# Altium schematic sheet CATS-EUROC-Telemetry.SchDoc: CATS EuRoC Edition
size A4; Author: Luca Jost; Revision: V1.0; SheetNumber: 11; SheetTotal: 16; Subtitle: Telemetry
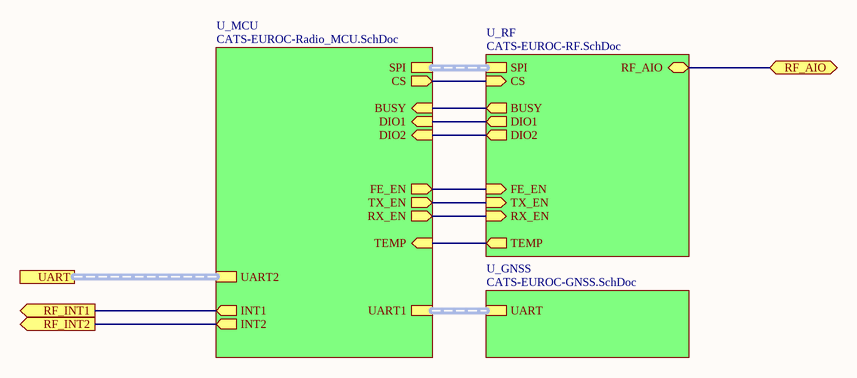
[diagram p0: CATS-EUROC-Telemetry.SchDoc]

## Sub-sheets
U_GNSS = CATS-EUROC-GNSS.SchDoc: UART (harness UART)
U_MCU = CATS-EUROC-Radio_MCU.SchDoc: SPI (harness SPI), CS (out), FE_EN (out), TX_EN (out), BUSY (in), DIO1 (in), DIO2 (in), TEMP (in), UART1 (harness UART), UART2 (harness UART), RX_EN (out), INT1 (out), INT2 (out)
U_RF = CATS-EUROC-RF.SchDoc: SPI (harness SPI), CS (in), BUSY (out), DIO1 (out), DIO2 (out), TEMP (out), FE_EN (in), TX_EN (in), RX_EN (in), RF_AIO (bidir)

## Ports
RF_AIO (bidir), RF_INT1 (out), RF_INT2 (out), UART

## Nets
RF_AIO: port RF_AIO, sheet U_RF/RF_AIO
RF_INT1: port RF_INT1, sheet U_MCU/INT1
RF_INT2: port RF_INT2, sheet U_MCU/INT2
(unnamed): sheet U_MCU/CS, sheet U_RF/CS
(unnamed): sheet U_MCU/FE_EN, sheet U_RF/FE_EN
(unnamed): sheet U_MCU/TX_EN, sheet U_RF/TX_EN
(unnamed): sheet U_MCU/BUSY, sheet U_RF/BUSY
(unnamed): sheet U_MCU/DIO1, sheet U_RF/DIO1
(unnamed): sheet U_MCU/DIO2, sheet U_RF/DIO2
(unnamed): sheet U_MCU/TEMP, sheet U_RF/TEMP
(unnamed): sheet U_MCU/RX_EN, sheet U_RF/RX_EN

## Buses and harness runs
harness port UART = sheet U_MCU/UART2
harness sheet U_GNSS/UART = sheet U_MCU/UART1
harness sheet U_MCU/SPI = sheet U_RF/SPI

## Notes on the sheet
- Title
- Author:
- Subtitle
- Date:
- Rev:
- File:
- Sheet
- of